# Altium schematic sheet P2_2478.SchDoc
size A4
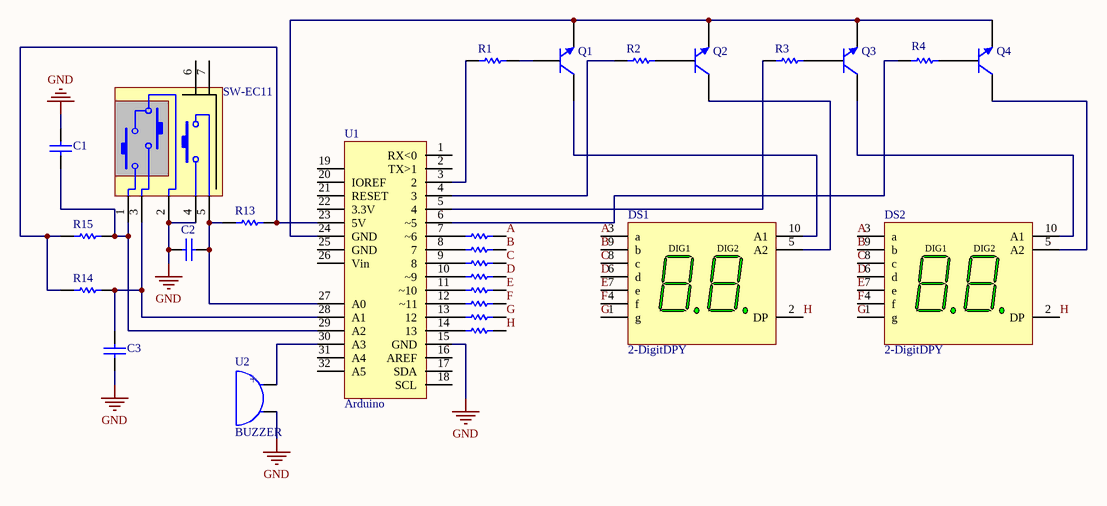
[diagram p0: P2_2478.SchDoc]

## Parts
C1  Cap  [RAD-0.2]  (value not drawn)
C2  Cap  [RAD-0.2]  (value not drawn)
C3  Cap  [RAD-0.2]  (value not drawn)
DS1  2-DigitDPY  [2-DigitDPY]
DS2  2-DigitDPY  [2-DigitDPY]
Q1  NPN  [TO-226]  (value not drawn)
Q2  NPN  [TO-226]  (value not drawn)
Q3  NPN  [TO-226]  (value not drawn)
Q4  NPN  [TO-226]  (value not drawn)
R1  Res1  [AXIAL-0.4]  (value not drawn)
R2  Res1  [AXIAL-0.4]  (value not drawn)
R3  Res1  [AXIAL-0.4]  (value not drawn)
R4  Res1  [AXIAL-0.4]  (value not drawn)
R5  Res1  [AXIAL-0.4]  (value not drawn)
R6  Res1  [AXIAL-0.4]  (value not drawn)
R7  Res1  [AXIAL-0.4]  (value not drawn)
R8  Res1  [AXIAL-0.4]  (value not drawn)
R9  Res1  [AXIAL-0.4]  (value not drawn)
R10  Res1  [AXIAL-0.4]  (value not drawn)
R11  Res1  [AXIAL-0.4]  (value not drawn)
R12  Res1  [AXIAL-0.4]  (value not drawn)
R13  Res1  [AXIAL-0.4]  (value not drawn)
R14  Res1  [AXIAL-0.4]  (value not drawn)
R15  Res1  [AXIAL-0.4]  (value not drawn)
SW-EC11  SW-EC11  [EC11]  (value not drawn)
U1  Arduino  [Arduino-UNO]
U2  BUZZER  [Buzzer]

## Nets
GND: C1.2 C2.2 C3.2 SW-EC11.2 SW-EC11.4 U1.15(GND) U2.2(B)
A: DS1.3(a) DS2.3(a) R5.2
B: DS1.9(b) DS2.9(b) R6.2
C: DS1.8(c) DS2.8(c) R7.2
D: DS1.6(d) DS2.6(d) R8.2
E: DS1.7(e) DS2.7(e) R9.2
F: DS1.4(f) DS2.4(f) R10.2
G: DS1.1(g) DS2.1(g) R11.2
H: DS1.2(DP) DS2.2(DP) R12.2
NetC1_1: C1.1 R15.2 SW-EC11.1 U1.29(A2)
NetC2_1: C2.1 R13.1 SW-EC11.5 U1.27(A0)
NetC3_1: C3.1 R14.2 SW-EC11.3 U1.28(A1)
NetDS1_5: DS1.5(A2) Q2.1(C)
NetDS1_10: DS1.10(A1) Q1.1(C)
NetDS2_5: DS2.5(A2) Q4.1(C)
NetDS2_10: DS2.10(A1) Q3.1(C)
NetQ1_2: Q1.2(B) R1.2
NetQ1_3: Q1.3(E) Q2.3(E) Q3.3(E) Q4.3(E) U1.24(GND)
NetQ2_2: Q2.2(B) R2.2
NetQ3_2: Q3.2(B) R3.2
NetQ4_2: Q4.2(B) R4.2
NetR1_1: R1.1 U1.3(2)
NetR2_1: R2.1 U1.4(3)
NetR3_1: R3.1 U1.5(4)
NetR4_1: R4.1 U1.6(~5)
NetR5_1: R5.1 U1.7(~6)
NetR6_1: R6.1 U1.8(7)
NetR7_1: R7.1 U1.9(8)
NetR8_1: R8.1 U1.10(~9)
NetR9_1: R9.1 U1.11(~10)
NetR10_1: R10.1 U1.12(~11)
NetR11_1: R11.1 U1.13(12)
NetR12_1: R12.1 U1.14(13)
NetR13_2: R13.2 R14.1 R15.1 U1.23(5V)
NetU1_30: U1.30(A3) U2.1(A)

Not connected (* = marked no-connect by the designer): SW-EC11 6 7; U1 1(RX<0) 2(TX>1) 16(AREF) 17(SDA) 18(SCL) 19 20(IOREF) 21(RESET) 22(3.3V) 25(GND) 26(Vin) 31(A4) 32(A5)

## Notes on the sheet
- (in symbol 2-DigitDPY) DIG1; DIG2
- (in symbol BUZZER) +

## Library data of the parts
C1-C3 = Cap: Capacitor; Value: 100pF; Published: 8-Jun-2000; LatestRevisionDate: 17-Jul-2002; LatestRevisionNote: Re-released for DXP Platform.; PackageReference: RAD-0.3; Publisher: Altium Limited
DS1 DS2 = 2-DigitDPY: 9.2 mm Green 7-Segment Display: 2-Digit, RH DP; LuminousIntensity: 1100 ucd (Minimum).; Published: 26-May-2004; LatestRevisionDate: 11-Oct-2004; LatestRevisionNote: Display outline superimposed on PCB Footprint.; DatasheetDocument: 14-Mar-2003; PackageDocument: 14-Mar-2003; PackageReference: HDSM-577; Publisher: Altium Limited; LED_Colour: Green; ComponentLink1Description: Manufacturer Link; ComponentLink1URL: http://www.agilent.com/
Q1-Q4 = NPN: NPN Bipolar Transistor; Published: 8-Jun-2000; LatestRevisionDate: 17-Jul-2002; LatestRevisionNote: Re-released for DXP Platform.; PackageReference: TO-226; Publisher: Altium Limited; Code_JEDEC: TO-226-AA
R1-R15 = Res1: Resistor; Value: 1K; Published: 8-Jun-2000; LatestRevisionDate: 17-Jul-2002; LatestRevisionNote: Re-released for DXP Platform.; PackageReference: AXIAL-0.3; Publisher: Altium Limited
SW-EC11 = SW-EC11: 旋转编码开关; Published: 24-Mar-1999; LatestRevisionDate: 17-Jul-2002; LatestRevisionNote: Re-released for DXP Platform.; PackageReference: SPST-2; Publisher: Altium Limited
U1 = Arduino-UNO